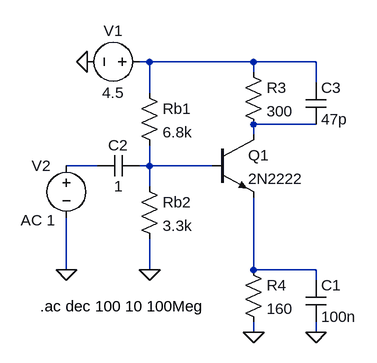
[diagram p0: schematic 2n2222_1_10_MHz_amp.asc]
2n2222_1_10_MHz_amp.asc, the LTspice schematic file:
Version 4
SHEET 1 880 680
WIRE 160 48 144 48
WIRE 320 48 160 48
WIRE 416 48 320 48
WIRE 320 64 320 48
WIRE 416 80 416 48
WIRE 160 96 160 48
WIRE 416 144 320 144
WIRE 320 160 320 144
WIRE 80 208 32 208
WIRE 160 208 160 176
WIRE 160 208 144 208
WIRE 256 208 160 208
WIRE 160 240 160 208
WIRE 32 368 32 288
WIRE 160 368 160 320
WIRE 320 368 320 256
WIRE 416 368 320 368
WIRE 416 384 416 368
WIRE 320 464 320 448
WIRE 416 464 416 448
FLAG 160 368 0
FLAG 320 464 0
FLAG 64 48 0
FLAG 32 368 0
FLAG 416 464 0
SYMBOL res 144 80 R0
SYMATTR InstName Rb1
SYMATTR Value 6.8k
SYMBOL res 144 224 R0
SYMATTR InstName Rb2
SYMATTR Value 3.3k
SYMBOL res 304 48 R0
SYMATTR InstName R3
SYMATTR Value 300
SYMBOL res 304 352 R0
SYMATTR InstName R4
SYMATTR Value 160
SYMBOL npn 256 160 R0
SYMATTR InstName Q1
SYMATTR Value 2N2222
SYMBOL voltage 160 48 R90
WINDOW 0 -32 56 VBottom 2
WINDOW 3 32 56 VTop 2
WINDOW 123 60 56 VTop 2
WINDOW 39 0 0 Left 0
SYMATTR InstName V1
SYMATTR Value 4.5
SYMBOL voltage 32 192 M0
WINDOW 123 17 100 Left 2
WINDOW 39 0 0 Left 0
SYMATTR InstName V2
SYMATTR Value ""
SYMATTR Value2 AC 1
SYMBOL cap 400 384 R0
SYMATTR InstName C1
SYMATTR Value 100n
SYMBOL cap 144 192 R90
WINDOW 0 0 32 VBottom 2
WINDOW 3 32 32 VTop 2
SYMATTR InstName C2
SYMATTR Value 1
SYMBOL cap 400 80 R0
SYMATTR InstName C3
SYMATTR Value 47p
TEXT -8 424 Left 2 !.ac dec 100 10 100Meg

The netlist it stands for:
* 2n2222_1_10_MHz_amp.asc
Rb1 N001 N004 6.8k
Rb2 N004 0 3.3k
R3 N001 N002 300
R4 N005 0 160
Q1 N002 N004 N005 0 2N2222
V1 N001 0 4.5
V2 N003 0 AC 1
C1 N005 0 100n
C2 N004 N003 1
C3 N001 N002 47p
.model NPN NPN
.model PNP PNP
.lib standard.bjt
.ac dec 100 10 100Meg
.backanno
.end